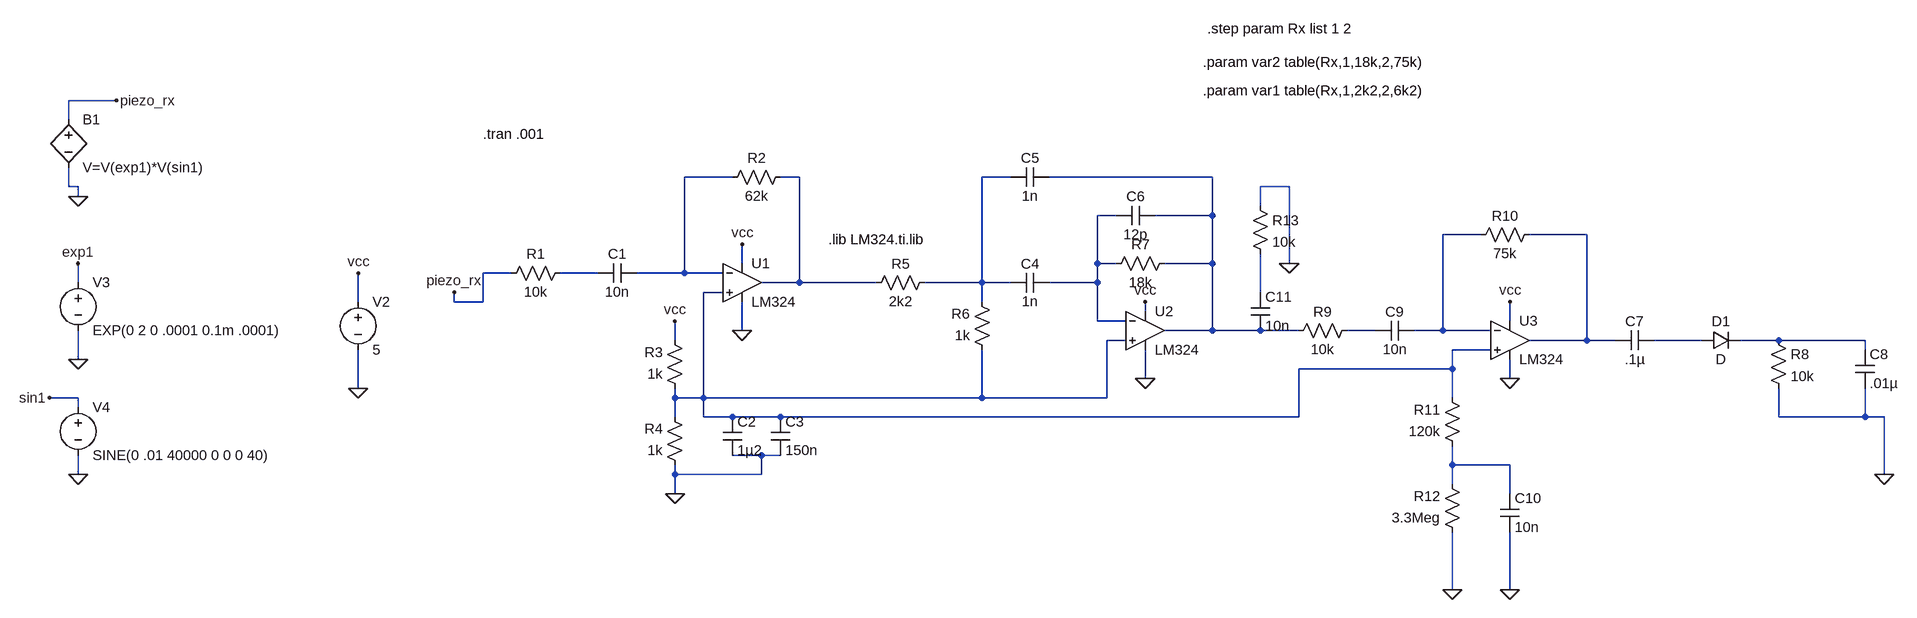
[diagram p0: schematic HC-SR04_receiver.asc]
HC-SR04_receiver.asc, the LTspice schematic file:
Version 4
SHEET 1 3064 680
WIRE -1088 -192 -1168 -192
WIRE -1168 -160 -1168 -192
WIRE 224 -64 144 -64
WIRE 336 -64 304 -64
WIRE 688 -64 640 -64
WIRE 1024 -64 752 -64
WIRE -1168 -48 -1168 -80
WIRE -1152 -48 -1168 -48
WIRE 1152 -48 1104 -48
WIRE -1152 -32 -1152 -48
WIRE 1104 -16 1104 -48
WIRE 864 0 832 0
WIRE 1024 0 1024 -64
WIRE 1024 0 928 0
WIRE 1472 32 1408 32
WIRE 1648 32 1552 32
WIRE 240 80 240 48
WIRE 832 80 832 0
WIRE 864 80 832 80
WIRE 1024 80 1024 0
WIRE 1024 80 944 80
WIRE 1152 80 1152 -48
WIRE -144 96 -192 96
WIRE 0 96 -64 96
WIRE 144 96 144 -64
WIRE 144 96 64 96
WIRE 208 96 144 96
WIRE -1152 112 -1152 80
WIRE 336 112 336 -64
WIRE 336 112 272 112
WIRE 464 112 336 112
WIRE 640 112 640 -64
WIRE 640 112 544 112
WIRE 688 112 640 112
WIRE 832 112 832 80
WIRE 832 112 752 112
WIRE 208 128 176 128
WIRE 1104 128 1104 64
WIRE -400 144 -400 96
WIRE -240 144 -240 128
WIRE -192 144 -192 96
WIRE -192 144 -240 144
WIRE 640 144 640 112
WIRE 912 160 912 144
WIRE 832 176 832 112
WIRE 880 176 832 176
WIRE 1520 176 1520 144
WIRE 240 192 240 144
WIRE 1024 192 1024 80
WIRE 1024 192 944 192
WIRE 1104 192 1024 192
WIRE 1168 192 1104 192
WIRE 1296 192 1248 192
WIRE 1408 192 1408 32
WIRE 1408 192 1360 192
WIRE 1488 192 1408 192
WIRE 128 208 128 176
WIRE 880 208 848 208
WIRE 1648 208 1648 32
WIRE 1648 208 1552 208
WIRE 1696 208 1648 208
WIRE 1840 208 1760 208
WIRE 1968 208 1904 208
WIRE 2112 208 1968 208
WIRE 1488 224 1424 224
WIRE 2112 224 2112 208
WIRE -1152 240 -1152 192
WIRE 1424 256 1424 224
WIRE 1424 256 1168 256
WIRE 912 272 912 224
WIRE 1520 272 1520 240
WIRE -400 288 -400 224
WIRE -1152 304 -1200 304
WIRE 128 304 128 288
WIRE 176 304 176 128
WIRE 176 304 128 304
WIRE 640 304 640 224
WIRE 640 304 176 304
WIRE 848 304 848 208
WIRE 848 304 640 304
WIRE 1424 304 1424 256
WIRE -1152 320 -1152 304
WIRE 128 336 128 304
WIRE 176 336 176 304
WIRE 224 336 176 336
WIRE 304 336 224 336
WIRE 1168 336 1168 256
WIRE 1168 336 304 336
WIRE 1968 336 1968 288
WIRE 2112 336 2112 288
WIRE 2112 336 1968 336
WIRE 2144 336 2112 336
WIRE 272 400 224 400
WIRE 304 400 272 400
WIRE 1424 416 1424 384
WIRE 1520 416 1424 416
WIRE -1152 432 -1152 400
WIRE 128 432 128 416
WIRE 272 432 272 400
WIRE 272 432 128 432
WIRE 2144 432 2144 336
WIRE 1424 448 1424 416
WIRE 128 464 128 432
WIRE 1520 464 1520 416
WIRE 1424 624 1424 528
WIRE 1520 624 1520 528
FLAG -400 96 vcc
FLAG -400 288 0
FLAG 128 176 vcc
FLAG 128 464 0
FLAG 240 48 vcc
FLAG 240 192 0
FLAG 912 144 vcc
FLAG 912 272 0
FLAG 2144 432 0
FLAG -1152 240 0
FLAG -1152 80 exp1
FLAG -1200 304 sin1
FLAG -1088 -192 piezo_rx
FLAG -1152 -32 0
FLAG -1152 432 0
FLAG -240 128 piezo_rx
FLAG 1424 624 0
FLAG 1520 624 0
FLAG 1520 144 vcc
FLAG 1520 272 0
FLAG 1152 80 0
SYMBOL Opamps\\opamp2 240 48 R0
SYMATTR InstName U1
SYMATTR Value LM324
SYMBOL voltage -400 128 R0
WINDOW 123 0 0 Left 0
WINDOW 39 0 0 Left 0
SYMATTR InstName V2
SYMATTR Value 5
SYMBOL res -48 80 R90
WINDOW 0 0 56 VBottom 2
WINDOW 3 32 56 VTop 2
SYMATTR InstName R1
SYMATTR Value 10k
SYMBOL cap 64 80 R90
WINDOW 0 0 32 VBottom 2
WINDOW 3 32 32 VTop 2
SYMATTR InstName C1
SYMATTR Value 10n
SYMBOL res 320 -80 R90
WINDOW 0 0 56 VBottom 2
WINDOW 3 32 56 VTop 2
SYMATTR InstName R2
SYMATTR Value 62k
SYMBOL res 144 304 R180
WINDOW 0 36 76 Left 2
WINDOW 3 36 40 Left 2
SYMATTR InstName R3
SYMATTR Value 1k
SYMBOL res 144 432 R180
WINDOW 0 36 76 Left 2
WINDOW 3 36 40 Left 2
SYMATTR InstName R4
SYMATTR Value 1k
SYMBOL cap 208 336 R0
SYMATTR InstName C2
SYMATTR Value 1µ2
SYMBOL cap 288 336 R0
SYMATTR InstName C3
SYMATTR Value 150n
SYMBOL res 560 96 R90
WINDOW 0 0 56 VBottom 2
WINDOW 3 32 56 VTop 2
SYMATTR InstName R5
SYMATTR Value 2k2
SYMBOL res 656 240 R180
WINDOW 0 36 76 Left 2
WINDOW 3 36 40 Left 2
SYMATTR InstName R6
SYMATTR Value 1k
SYMBOL cap 752 96 R90
WINDOW 0 0 32 VBottom 2
WINDOW 3 32 32 VTop 2
SYMATTR InstName C4
SYMATTR Value 1n
SYMBOL cap 752 -80 R90
WINDOW 0 0 32 VBottom 2
WINDOW 3 32 32 VTop 2
SYMATTR InstName C5
SYMATTR Value 1n
SYMBOL cap 928 -16 R90
WINDOW 0 0 32 VBottom 2
WINDOW 3 32 32 VTop 2
SYMATTR InstName C6
SYMATTR Value 12p
SYMBOL res 960 64 R90
WINDOW 0 0 56 VBottom 2
WINDOW 3 32 56 VTop 2
SYMATTR InstName R7
SYMATTR Value 18k
SYMBOL Opamps\\opamp2 912 128 R0
SYMATTR InstName U2
SYMATTR Value LM324
SYMBOL voltage -1152 96 R0
WINDOW 123 0 0 Left 0
WINDOW 39 0 0 Left 0
SYMATTR InstName V3
SYMATTR Value EXP(0 2 0 .0001 0.1m .0001)
SYMBOL voltage -1152 304 R0
WINDOW 123 0 0 Left 0
WINDOW 39 0 0 Left 0
SYMATTR InstName V4
SYMATTR Value SINE(0 .01 40000 0 0 0 40)
SYMBOL bv -1168 -176 R0
SYMATTR InstName B1
SYMATTR Value V=V(exp1)*V(sin1)
SYMBOL res 1264 176 R90
WINDOW 0 0 56 VBottom 2
WINDOW 3 32 56 VTop 2
SYMATTR InstName R9
SYMATTR Value 10k
SYMBOL cap 1360 176 R90
WINDOW 0 0 32 VBottom 2
WINDOW 3 32 32 VTop 2
SYMATTR InstName C9
SYMATTR Value 10n
SYMBOL Opamps\\opamp2 1520 144 R0
SYMATTR InstName U3
SYMATTR Value LM324
SYMBOL res 1568 16 R90
WINDOW 0 0 56 VBottom 2
WINDOW 3 32 56 VTop 2
SYMATTR InstName R10
SYMATTR Value 75k
SYMBOL res 1440 400 R180
WINDOW 0 36 76 Left 2
WINDOW 3 36 40 Left 2
SYMATTR InstName R11
SYMATTR Value 120k
SYMBOL res 1440 544 R180
WINDOW 0 36 76 Left 2
WINDOW 3 36 40 Left 2
SYMATTR InstName R12
SYMATTR Value 3.3Meg
SYMBOL cap 1504 464 R0
SYMATTR InstName C10
SYMATTR Value 10n
SYMBOL cap 1088 128 R0
SYMATTR InstName C11
SYMATTR Value 10n
SYMBOL res 1088 -32 R0
SYMATTR InstName R13
SYMATTR Value 10k
SYMBOL diode 1840 224 R270
WINDOW 0 32 32 VTop 2
WINDOW 3 0 32 VBottom 2
SYMATTR InstName D1
SYMBOL res 1952 192 R0
SYMATTR InstName R8
SYMATTR Value 10k
SYMBOL cap 1760 192 R90
WINDOW 0 0 32 VBottom 2
WINDOW 3 32 32 VTop 2
SYMATTR InstName C7
SYMATTR Value .1µ
SYMBOL cap 2096 224 R0
SYMATTR InstName C8
SYMATTR Value .01µ
TEXT 384 40 Left 2 !.lib LM324.ti.lib
TEXT -192 -136 Left 2 !.tran .001
TEXT 1016 -312 Left 2 !.step param Rx list 1 2
TEXT 1008 -256 Left 2 !.param var2 table(Rx,1,18k,2,75k)
TEXT 1008 -208 Left 2 !.param var1 table(Rx,1,2k2,2,6k2)

The netlist it stands for:
* HC-SR04_receiver.asc
XU1 N009 N001 vcc 0 N002 LM324  ; pins In+ In- V+ V- OUT
V2 vcc 0 5
R1 N008 piezo_rx 10k
C1 N001 N008 10n
R2 N002 N001 62k
R3 N009 vcc 1k
R4 0 N009 1k
C2 N009 0 1µ2
C3 N009 0 150n
R5 N003 N002 2k2
R6 N009 N003 1k
C4 N005 N003 1n
C5 N004 N003 1n
C6 N004 N005 12p
R7 N004 N005 18k
XU2 N009 N005 vcc 0 N004 LM324  ; pins In+ In- V+ V- OUT
V3 exp1 0 EXP(0 2 0 .0001 0.1m .0001)
V4 sin1 0 SINE(0 .01 40000 0 0 0 40)
B1 piezo_rx 0 V=V(exp1)*V(sin1)
R9 N011 N004 10k
C9 N006 N011 10n
XU3 N009 N006 vcc 0 N007 LM324  ; pins In+ In- V+ V- OUT
R10 N007 N006 75k
R11 N014 N009 120k
R12 0 N014 3.3Meg
C10 N014 0 10n
C11 N010 N004 10n
R13 0 N010 10k
D1 N012 N013 D
R8 N013 0 10k
C7 N012 N007 .1µ
C8 N013 0 .01µ
.model D D
.lib standard.dio
.lib LM324.ti.lib
.tran .001
.step param Rx list 1 2
.param var2 table(Rx,1,18k,2,75k)
.param var1 table(Rx,1,2k2,2,6k2)
.backanno
.end